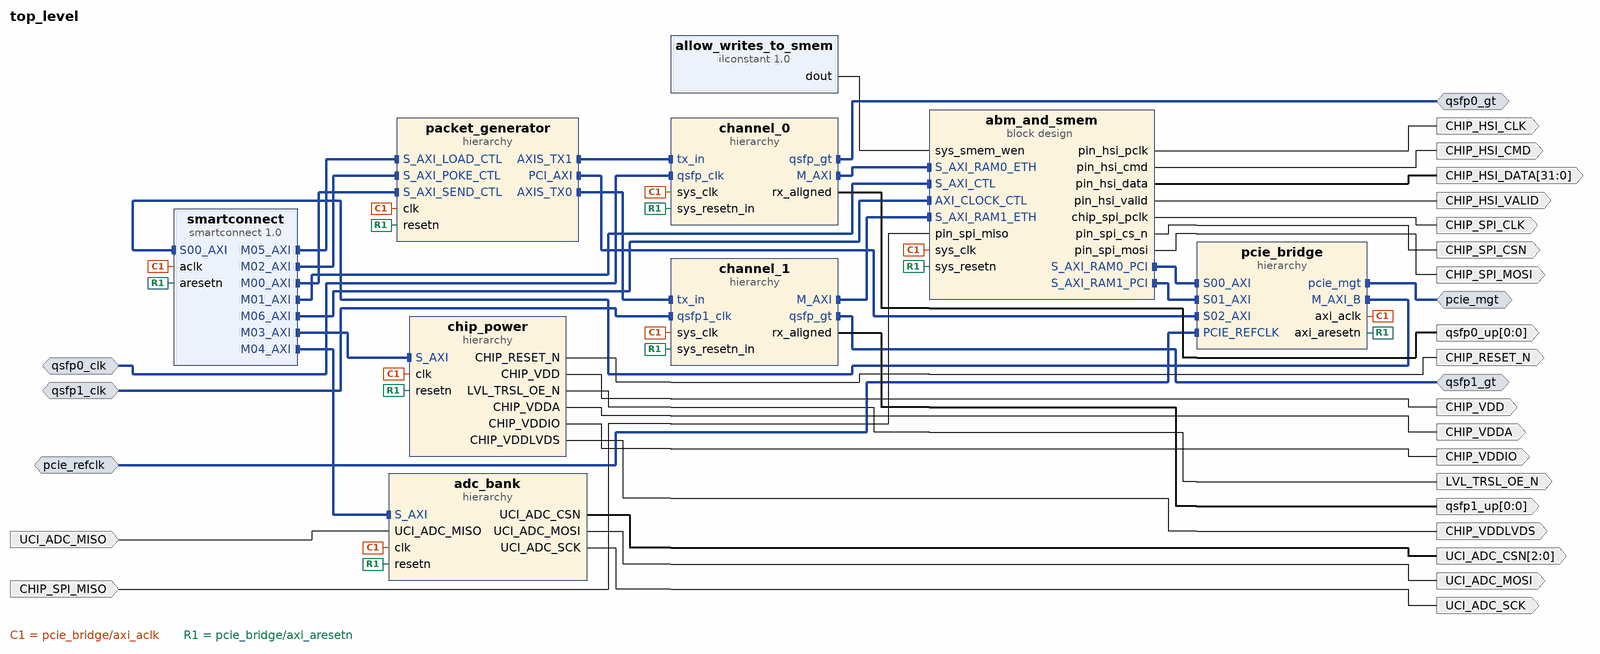
[diagram p0: block diagram of the top level]
# Vivado block design top_level, xcku15p-ffve1517-3-e, Vivado 2024.2
create_bd_design top_level

create_bd_intf_port -mode Slave -vlnv xilinx.com:interface:diff_clock_rtl:1.0 pcie_refclk
create_bd_intf_port -mode Master -vlnv xilinx.com:interface:pcie_7x_mgt_rtl:1.0 pcie_mgt
create_bd_intf_port -mode Master -vlnv xilinx.com:interface:gt_rtl:1.0 qsfp0_gt
create_bd_intf_port -mode Slave -vlnv xilinx.com:interface:diff_clock_rtl:1.0 qsfp0_clk
set_property -dict {CONFIG.FREQ_HZ 322265625} [get_bd_intf_ports qsfp0_clk]
create_bd_intf_port -mode Master -vlnv xilinx.com:interface:gt_rtl:1.0 qsfp1_gt
create_bd_intf_port -mode Slave -vlnv xilinx.com:interface:diff_clock_rtl:1.0 qsfp1_clk
set_property -dict {CONFIG.FREQ_HZ 322265625} [get_bd_intf_ports qsfp1_clk]
create_bd_port -dir O -from 0 -to 0 qsfp0_up
create_bd_port -dir O -from 0 -to 0 qsfp1_up
create_bd_port -dir O CHIP_HSI_CLK
create_bd_port -dir O CHIP_HSI_CMD
create_bd_port -dir O -from 31 -to 0 CHIP_HSI_DATA
create_bd_port -dir O CHIP_HSI_VALID
create_bd_port -dir O CHIP_SPI_CLK
create_bd_port -dir O CHIP_SPI_CSN
create_bd_port -dir O CHIP_SPI_MOSI
create_bd_port -dir I CHIP_SPI_MISO
create_bd_port -dir O CHIP_VDDIO
create_bd_port -dir O CHIP_VDD
create_bd_port -dir O CHIP_VDDLVDS
create_bd_port -dir O CHIP_VDDA
create_bd_port -dir O CHIP_RESET_N
create_bd_port -dir O -from 2 -to 0 UCI_ADC_CSN
create_bd_port -dir O UCI_ADC_SCK
create_bd_port -dir O UCI_ADC_MOSI
create_bd_port -dir I UCI_ADC_MISO
create_bd_port -dir O LVL_TRSL_OE_N

create_bd_cell -type hier pcie_bridge
create_bd_cell -type ip -vlnv xilinx.com:ip:smartconnect:1.0 smartconnect
set_property -dict {CONFIG.NUM_MI 7 CONFIG.NUM_SI 1} [get_bd_cells smartconnect]
create_bd_cell -type hier packet_generator
create_bd_cell -type inline_hdl -vlnv xilinx.com:inline_hdl:ilconstant:1.0 allow_writes_to_smem
create_bd_cell -type container -reference abm_and_smem abm_and_smem
set_property -dict [list \
  CONFIG.ACTIVE_SIM_BD abm_and_smem.bd \
  CONFIG.ACTIVE_SYNTH_BD abm_and_smem.bd \
  CONFIG.ENABLE_DFX 0 \
  CONFIG.LIST_SIM_BD abm_and_smem.bd \
  CONFIG.LIST_SYNTH_BD abm_and_smem.bd \
  CONFIG.LOCK_PROPAGATE 0 \
] [get_bd_cells abm_and_smem]
create_bd_cell -type hier chip_power
create_bd_cell -type hier channel_1
create_bd_cell -type hier adc_bank
create_bd_cell -type hier channel_0

# ---- hierarchy /pcie_bridge ----
current_bd_instance /pcie_bridge
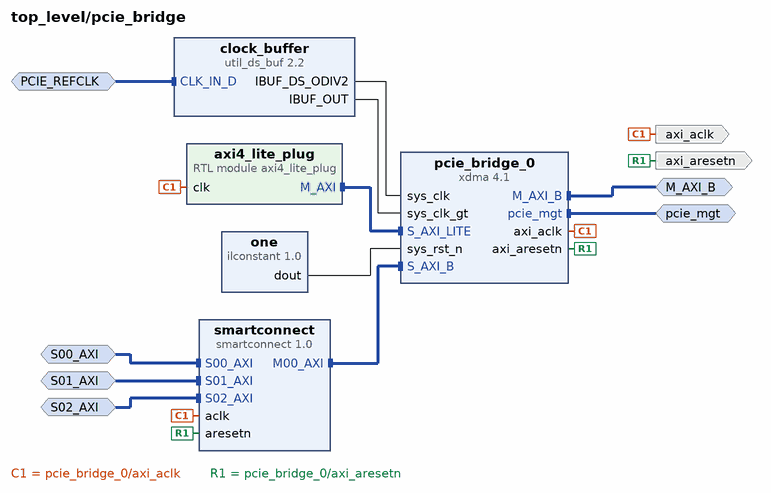
[diagram p1: block diagram inside /pcie_bridge]
create_bd_intf_pin -mode Slave -vlnv xilinx.com:interface:diff_clock_rtl:1.0 PCIE_REFCLK
create_bd_intf_pin -mode Slave -vlnv xilinx.com:interface:aximm_rtl:1.0 S00_AXI
create_bd_intf_pin -mode Slave -vlnv xilinx.com:interface:aximm_rtl:1.0 S01_AXI
create_bd_intf_pin -mode Master -vlnv xilinx.com:interface:pcie_7x_mgt_rtl:1.0 pcie_mgt
create_bd_intf_pin -mode Master -vlnv xilinx.com:interface:aximm_rtl:1.0 M_AXI_B
create_bd_intf_pin -mode Slave -vlnv xilinx.com:interface:aximm_rtl:1.0 S02_AXI
create_bd_pin -dir O -type clk axi_aclk
create_bd_pin -dir O -type rst axi_aresetn

create_bd_cell -type ip -vlnv xilinx.com:ip:util_ds_buf:2.2 clock_buffer
set_property -dict {CONFIG.C_BUF_TYPE IBUFDSGTE} [get_bd_cells clock_buffer]
create_bd_cell -type ip -vlnv xilinx.com:ip:smartconnect:1.0 smartconnect
set_property -dict {CONFIG.NUM_MI 1 CONFIG.NUM_SI 3} [get_bd_cells smartconnect]
create_bd_cell -type module -reference axi4_lite_plug axi4_lite_plug
create_bd_cell -type ip -vlnv xilinx.com:ip:xdma:4.1 pcie_bridge_0
set_property -dict [list \
  CONFIG.PF0_DEVICE_ID_mqdma 903F \
  CONFIG.PF0_SRIOV_VF_DEVICE_ID A03F \
  CONFIG.PF2_DEVICE_ID_mqdma 923F \
  CONFIG.PF3_DEVICE_ID_mqdma 933F \
  CONFIG.axi_addr_width 64 \
  CONFIG.axi_data_width 512_bit \
  CONFIG.axisten_freq 250 \
  CONFIG.bridge_burst true \
  CONFIG.en_axi_slave_if true \
  CONFIG.en_gt_selection false \
  CONFIG.functional_mode AXI_Bridge \
  CONFIG.mode_selection Advanced \
  CONFIG.pcie_blk_locn X0Y3 \
  CONFIG.pf0_bar0_scale Megabytes \
  CONFIG.pf0_bar0_size 1 \
  CONFIG.pf0_device_id 903F \
  CONFIG.pf0_msi_enabled false \
  CONFIG.pl_link_cap_max_link_speed 8.0_GT/s \
  CONFIG.pl_link_cap_max_link_width X16 \
  CONFIG.runbit_fix false \
  CONFIG.xlnx_ref_board None \
] [get_bd_cells pcie_bridge_0]
create_bd_cell -type inline_hdl -vlnv xilinx.com:inline_hdl:ilconstant:1.0 one

# ---- hierarchy /packet_generator ----
current_bd_instance /packet_generator
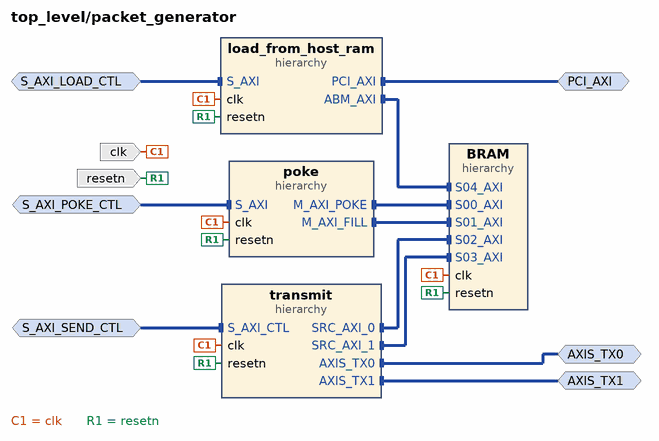
[diagram p2: block diagram inside /packet_generator]
create_bd_intf_pin -mode Slave -vlnv xilinx.com:interface:aximm_rtl:1.0 S_AXI_POKE_CTL
create_bd_intf_pin -mode Slave -vlnv xilinx.com:interface:aximm_rtl:1.0 S_AXI_SEND_CTL
create_bd_intf_pin -mode Master -vlnv xilinx.com:interface:axis_rtl:1.0 AXIS_TX0
create_bd_intf_pin -mode Master -vlnv xilinx.com:interface:axis_rtl:1.0 AXIS_TX1
create_bd_intf_pin -mode Slave -vlnv xilinx.com:interface:aximm_rtl:1.0 S_AXI_LOAD_CTL
create_bd_intf_pin -mode Master -vlnv xilinx.com:interface:aximm_rtl:1.0 PCI_AXI
create_bd_pin -dir I resetn
create_bd_pin -dir I clk

create_bd_cell -type hier poke
create_bd_cell -type hier transmit
create_bd_cell -type hier BRAM
create_bd_cell -type hier load_from_host_ram

# ---- hierarchy /packet_generator/poke ----
current_bd_instance /packet_generator/poke
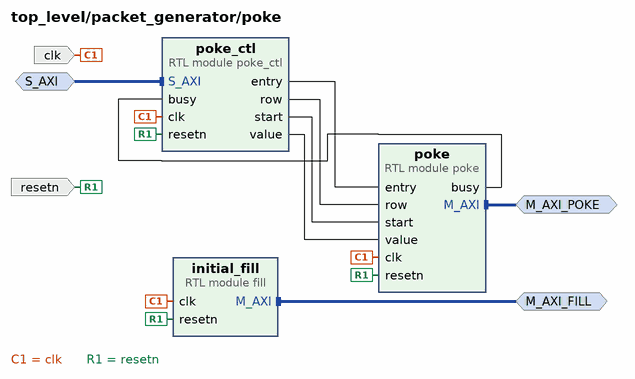
[diagram p3: block diagram inside /packet_generator/poke]
create_bd_intf_pin -mode Slave -vlnv xilinx.com:interface:aximm_rtl:1.0 S_AXI
create_bd_intf_pin -mode Master -vlnv xilinx.com:interface:aximm_rtl:1.0 M_AXI_POKE
create_bd_intf_pin -mode Master -vlnv xilinx.com:interface:aximm_rtl:1.0 M_AXI_FILL
create_bd_pin -dir I clk
create_bd_pin -dir I resetn

create_bd_cell -type module -reference poke_ctl poke_ctl
create_bd_cell -type module -reference poke poke
create_bd_cell -type module -reference fill initial_fill

# ---- hierarchy /packet_generator/transmit ----
current_bd_instance /packet_generator/transmit
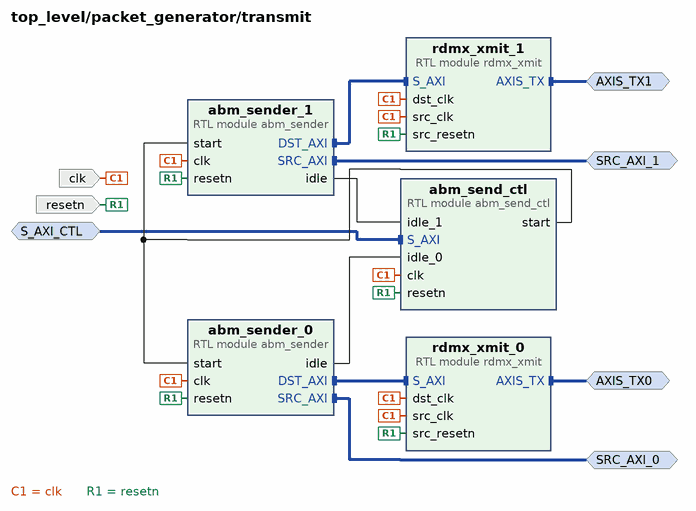
[diagram p4: block diagram inside /packet_generator/transmit]
create_bd_intf_pin -mode Master -vlnv xilinx.com:interface:aximm_rtl:1.0 SRC_AXI_0
create_bd_intf_pin -mode Master -vlnv xilinx.com:interface:axis_rtl:1.0 AXIS_TX0
create_bd_intf_pin -mode Master -vlnv xilinx.com:interface:axis_rtl:1.0 AXIS_TX1
create_bd_intf_pin -mode Master -vlnv xilinx.com:interface:aximm_rtl:1.0 SRC_AXI_1
create_bd_intf_pin -mode Slave -vlnv xilinx.com:interface:aximm_rtl:1.0 S_AXI_CTL
create_bd_pin -dir I clk
create_bd_pin -dir I resetn

create_bd_cell -type module -reference abm_sender abm_sender_0
create_bd_cell -type module -reference rdmx_xmit rdmx_xmit_0
set_property -dict {CONFIG.FIFO_CLOCK_MODE common_clk CONFIG.SRC_MAC 0} [get_bd_cells rdmx_xmit_0]
create_bd_cell -type module -reference rdmx_xmit rdmx_xmit_1
set_property -dict {CONFIG.FIFO_CLOCK_MODE common_clk CONFIG.SRC_MAC 1} [get_bd_cells rdmx_xmit_1]
create_bd_cell -type module -reference abm_sender abm_sender_1
create_bd_cell -type module -reference abm_send_ctl abm_send_ctl

# ---- hierarchy /packet_generator/BRAM ----
current_bd_instance /packet_generator/BRAM
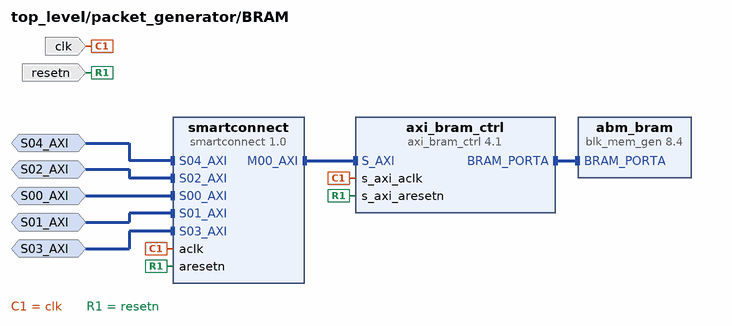
[diagram p5: block diagram inside /packet_generator/BRAM]
create_bd_intf_pin -mode Slave -vlnv xilinx.com:interface:aximm_rtl:1.0 S00_AXI
create_bd_intf_pin -mode Slave -vlnv xilinx.com:interface:aximm_rtl:1.0 S01_AXI
create_bd_intf_pin -mode Slave -vlnv xilinx.com:interface:aximm_rtl:1.0 S02_AXI
create_bd_intf_pin -mode Slave -vlnv xilinx.com:interface:aximm_rtl:1.0 S03_AXI
create_bd_intf_pin -mode Slave -vlnv xilinx.com:interface:aximm_rtl:1.0 S04_AXI
create_bd_pin -dir I clk
create_bd_pin -dir I resetn

create_bd_cell -type ip -vlnv xilinx.com:ip:smartconnect:1.0 smartconnect
set_property -dict {CONFIG.NUM_SI 5} [get_bd_cells smartconnect]
create_bd_cell -type ip -vlnv xilinx.com:ip:axi_bram_ctrl:4.1 axi_bram_ctrl
set_property -dict {CONFIG.DATA_WIDTH 512 CONFIG.SINGLE_PORT_BRAM 1 CONFIG.SUPPORTS_NARROW_BURST 0} [get_bd_cells axi_bram_ctrl]
create_bd_cell -type ip -vlnv xilinx.com:ip:blk_mem_gen:8.4 abm_bram
set_property -dict {CONFIG.PRIM_type_to_Implement URAM} [get_bd_cells abm_bram]

# ---- hierarchy /packet_generator/load_from_host_ram ----
current_bd_instance /packet_generator/load_from_host_ram
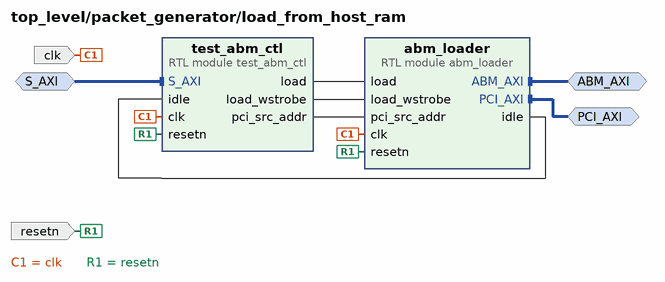
[diagram p6: block diagram inside /packet_generator/load_from_host_ram]
create_bd_intf_pin -mode Slave -vlnv xilinx.com:interface:aximm_rtl:1.0 S_AXI
create_bd_intf_pin -mode Master -vlnv xilinx.com:interface:aximm_rtl:1.0 ABM_AXI
create_bd_intf_pin -mode Master -vlnv xilinx.com:interface:aximm_rtl:1.0 PCI_AXI
create_bd_pin -dir I clk
create_bd_pin -dir I resetn

create_bd_cell -type module -reference test_abm_ctl test_abm_ctl
create_bd_cell -type module -reference abm_loader abm_loader

# ---- hierarchy /chip_power ----
current_bd_instance /chip_power
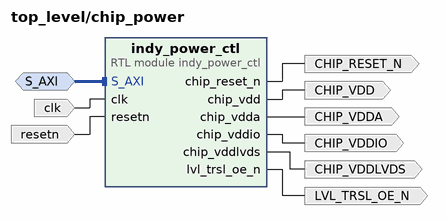
[diagram p7: block diagram inside /chip_power]
create_bd_intf_pin -mode Slave -vlnv xilinx.com:interface:aximm_rtl:1.0 S_AXI
create_bd_pin -dir I -type clk clk
create_bd_pin -dir I -type rst resetn
create_bd_pin -dir O CHIP_VDDIO
create_bd_pin -dir O CHIP_VDD
create_bd_pin -dir O CHIP_VDDLVDS
create_bd_pin -dir O CHIP_VDDA
create_bd_pin -dir O CHIP_RESET_N
create_bd_pin -dir O LVL_TRSL_OE_N

create_bd_cell -type module -reference indy_power_ctl indy_power_ctl

# ---- hierarchy /channel_1 ----
current_bd_instance /channel_1
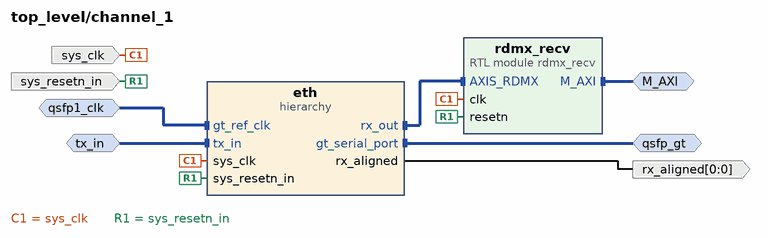
[diagram p8: block diagram inside /channel_1]
create_bd_intf_pin -mode Master -vlnv xilinx.com:interface:gt_rtl:1.0 qsfp_gt
create_bd_intf_pin -mode Slave -vlnv xilinx.com:interface:diff_clock_rtl:1.0 qsfp1_clk
create_bd_intf_pin -mode Slave -vlnv xilinx.com:interface:axis_rtl:1.0 tx_in
create_bd_intf_pin -mode Master -vlnv xilinx.com:interface:aximm_rtl:1.0 M_AXI
create_bd_pin -dir I sys_clk
create_bd_pin -dir I sys_resetn_in
create_bd_pin -dir O -from 0 -to 0 rx_aligned

create_bd_cell -type hier eth
create_bd_cell -type module -reference rdmx_recv rdmx_recv

# ---- hierarchy /channel_1/eth ----
current_bd_instance /channel_1/eth
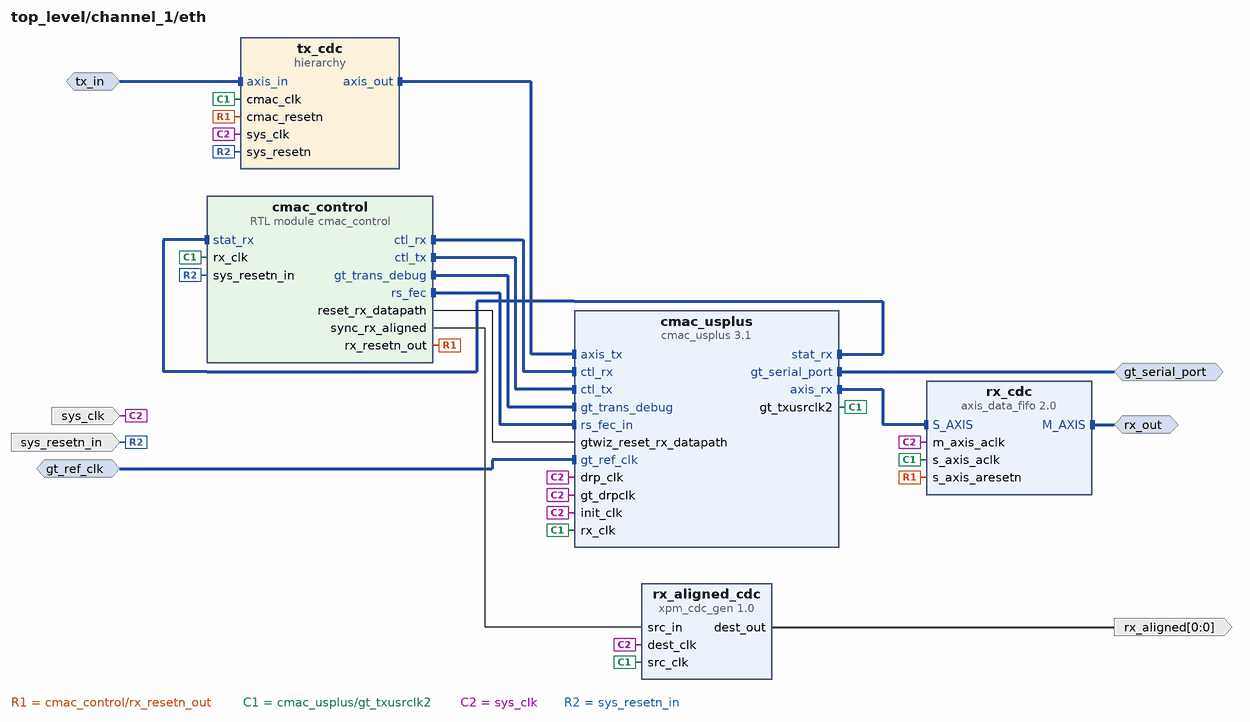
[diagram p9: block diagram inside /channel_1/eth]
create_bd_intf_pin -mode Master -vlnv xilinx.com:interface:gt_rtl:1.0 gt_serial_port
create_bd_intf_pin -mode Slave -vlnv xilinx.com:interface:diff_clock_rtl:1.0 gt_ref_clk
create_bd_intf_pin -mode Master -vlnv xilinx.com:interface:axis_rtl:1.0 rx_out
create_bd_intf_pin -mode Slave -vlnv xilinx.com:interface:axis_rtl:1.0 tx_in
create_bd_pin -dir I sys_resetn_in
create_bd_pin -dir I sys_clk
create_bd_pin -dir O -from 0 -to 0 rx_aligned

create_bd_cell -type ip -vlnv xilinx.com:ip:cmac_usplus:3.1 cmac_usplus
set_property -dict [list \
  CONFIG.ADD_GT_CNRL_STS_PORTS 1 \
  CONFIG.CMAC_CAUI4_MODE 1 \
  CONFIG.CMAC_CORE_SELECT CMACE4_X0Y1 \
  CONFIG.DIFFCLK_BOARD_INTERFACE Custom \
  CONFIG.ETHERNET_BOARD_INTERFACE Custom \
  CONFIG.GT_DRP_CLK 250 \
  CONFIG.GT_GROUP_SELECT {X0Y4~X0Y7} \
  CONFIG.GT_REF_CLK_FREQ 322.265625 \
  CONFIG.INCLUDE_RS_FEC 1 \
  CONFIG.NUM_LANES 4x25 \
  CONFIG.RX_FLOW_CONTROL 0 \
  CONFIG.RX_GT_BUFFER 1 \
  CONFIG.TX_FLOW_CONTROL 0 \
  CONFIG.USER_INTERFACE AXIS \
] [get_bd_cells cmac_usplus]
create_bd_cell -type module -reference cmac_control cmac_control
set_property -dict {CONFIG.TX_PRECURSOR {"10100"}} [get_bd_cells cmac_control]
create_bd_cell -type ip -vlnv xilinx.com:ip:axis_data_fifo:2.0 rx_cdc
set_property -dict {CONFIG.FIFO_DEPTH 16 CONFIG.IS_ACLK_ASYNC 1} [get_bd_cells rx_cdc]
create_bd_cell -type ip -vlnv xilinx.com:ip:xpm_cdc_gen:1.0 rx_aligned_cdc
set_property -dict [list \
  CONFIG.CDC_TYPE xpm_cdc_single \
  CONFIG.SIM_ASSERT_CHK false \
  CONFIG.SRC_INPUT_REG false \
  CONFIG.WIDTH 1 \
] [get_bd_cells rx_aligned_cdc]
create_bd_cell -type hier tx_cdc

# ---- hierarchy /channel_1/eth/tx_cdc ----
current_bd_instance /channel_1/eth/tx_cdc
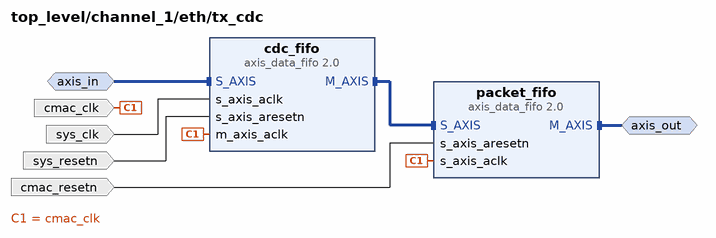
[diagram p10: block diagram inside /channel_1/eth/tx_cdc]
create_bd_intf_pin -mode Slave -vlnv xilinx.com:interface:axis_rtl:1.0 axis_in
create_bd_intf_pin -mode Master -vlnv xilinx.com:interface:axis_rtl:1.0 axis_out
create_bd_pin -dir I sys_clk
create_bd_pin -dir I sys_resetn
create_bd_pin -dir I cmac_clk
create_bd_pin -dir I cmac_resetn

create_bd_cell -type ip -vlnv xilinx.com:ip:axis_data_fifo:2.0 cdc_fifo
set_property -dict {CONFIG.FIFO_DEPTH 16 CONFIG.IS_ACLK_ASYNC 1} [get_bd_cells cdc_fifo]
create_bd_cell -type ip -vlnv xilinx.com:ip:axis_data_fifo:2.0 packet_fifo
set_property -dict {CONFIG.FIFO_MODE 2 CONFIG.IS_ACLK_ASYNC 0} [get_bd_cells packet_fifo]

# ---- hierarchy /adc_bank ----
current_bd_instance /adc_bank
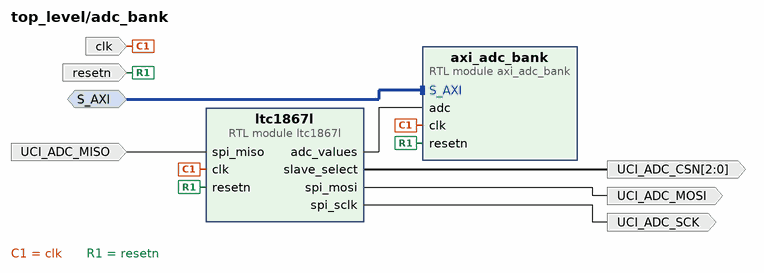
[diagram p11: block diagram inside /adc_bank]
create_bd_intf_pin -mode Slave -vlnv xilinx.com:interface:aximm_rtl:1.0 S_AXI
create_bd_pin -dir I -type clk clk
create_bd_pin -dir I -type rst resetn
create_bd_pin -dir O -from 2 -to 0 UCI_ADC_CSN
create_bd_pin -dir O UCI_ADC_SCK
create_bd_pin -dir O UCI_ADC_MOSI
create_bd_pin -dir I UCI_ADC_MISO

create_bd_cell -type module -reference axi_adc_bank axi_adc_bank
set_property -dict {CONFIG.ADC_COUNT 3} [get_bd_cells axi_adc_bank]
create_bd_cell -type module -reference ltc1867l ltc1867l
set_property -dict {CONFIG.ADC_COUNT 3} [get_bd_cells ltc1867l]

# ---- hierarchy /channel_0 ----
current_bd_instance /channel_0
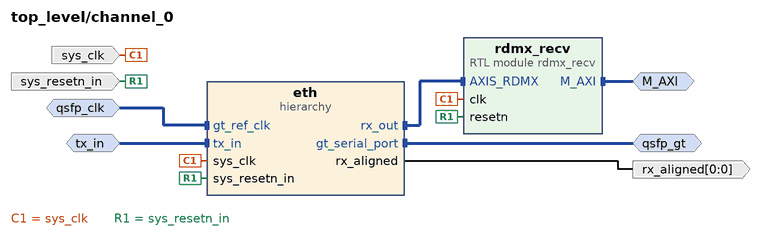
[diagram p12: block diagram inside /channel_0]
create_bd_intf_pin -mode Master -vlnv xilinx.com:interface:gt_rtl:1.0 qsfp_gt
create_bd_intf_pin -mode Slave -vlnv xilinx.com:interface:diff_clock_rtl:1.0 qsfp_clk
create_bd_intf_pin -mode Slave -vlnv xilinx.com:interface:axis_rtl:1.0 tx_in
create_bd_intf_pin -mode Master -vlnv xilinx.com:interface:aximm_rtl:1.0 M_AXI
create_bd_pin -dir I sys_clk
create_bd_pin -dir I sys_resetn_in
create_bd_pin -dir O -from 0 -to 0 rx_aligned

create_bd_cell -type hier eth
create_bd_cell -type module -reference rdmx_recv rdmx_recv

# ---- hierarchy /channel_0/eth ----
current_bd_instance /channel_0/eth
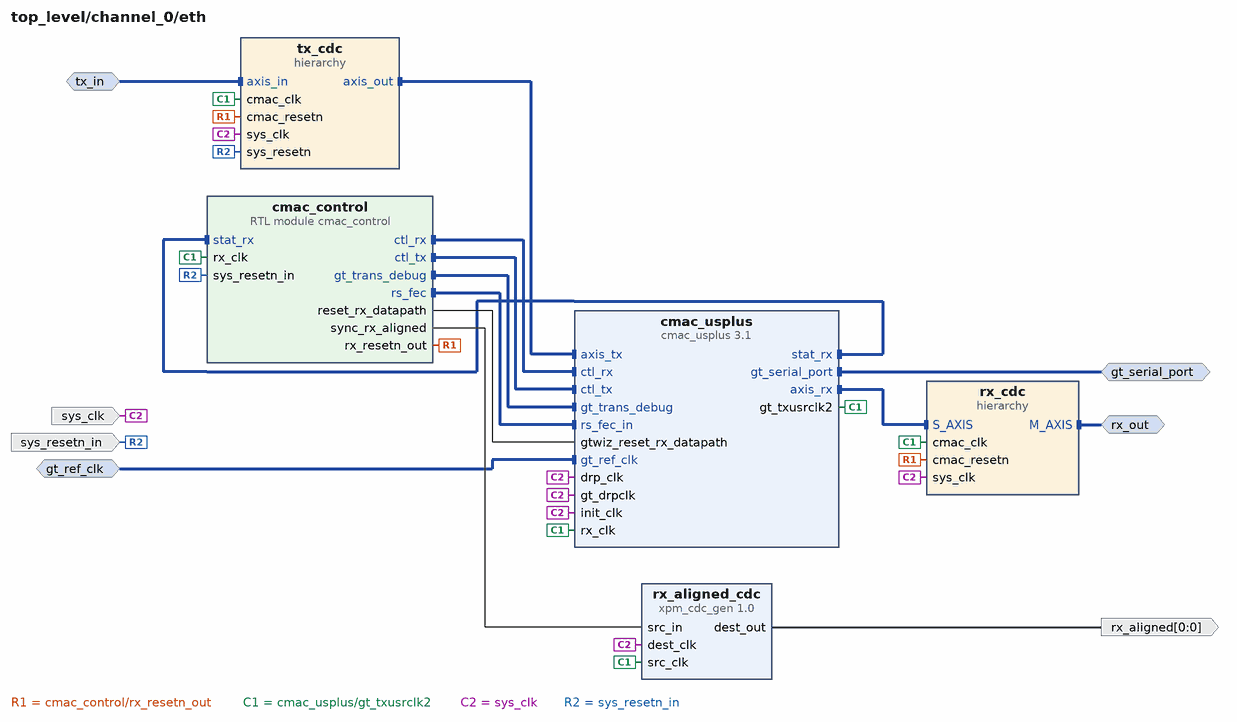
[diagram p13: block diagram inside /channel_0/eth]
create_bd_intf_pin -mode Master -vlnv xilinx.com:interface:gt_rtl:1.0 gt_serial_port
create_bd_intf_pin -mode Slave -vlnv xilinx.com:interface:diff_clock_rtl:1.0 gt_ref_clk
create_bd_intf_pin -mode Master -vlnv xilinx.com:interface:axis_rtl:1.0 rx_out
create_bd_intf_pin -mode Slave -vlnv xilinx.com:interface:axis_rtl:1.0 tx_in
create_bd_pin -dir I sys_resetn_in
create_bd_pin -dir I sys_clk
create_bd_pin -dir O -from 0 -to 0 rx_aligned

create_bd_cell -type ip -vlnv xilinx.com:ip:cmac_usplus:3.1 cmac_usplus
set_property -dict [list \
  CONFIG.ADD_GT_CNRL_STS_PORTS 1 \
  CONFIG.CMAC_CAUI4_MODE 1 \
  CONFIG.CMAC_CORE_SELECT CMACE4_X0Y0 \
  CONFIG.DIFFCLK_BOARD_INTERFACE Custom \
  CONFIG.ETHERNET_BOARD_INTERFACE Custom \
  CONFIG.GT_DRP_CLK 250 \
  CONFIG.GT_GROUP_SELECT {X0Y0~X0Y3} \
  CONFIG.GT_REF_CLK_FREQ 322.265625 \
  CONFIG.INCLUDE_RS_FEC 1 \
  CONFIG.NUM_LANES 4x25 \
  CONFIG.RX_FLOW_CONTROL 0 \
  CONFIG.RX_GT_BUFFER 1 \
  CONFIG.TX_FLOW_CONTROL 0 \
  CONFIG.USER_INTERFACE AXIS \
] [get_bd_cells cmac_usplus]
create_bd_cell -type module -reference cmac_control cmac_control
set_property -dict {CONFIG.TX_PRECURSOR {"10100"}} [get_bd_cells cmac_control]
create_bd_cell -type ip -vlnv xilinx.com:ip:xpm_cdc_gen:1.0 rx_aligned_cdc
set_property -dict [list \
  CONFIG.CDC_TYPE xpm_cdc_single \
  CONFIG.SIM_ASSERT_CHK false \
  CONFIG.SRC_INPUT_REG false \
  CONFIG.WIDTH 1 \
] [get_bd_cells rx_aligned_cdc]
create_bd_cell -type hier tx_cdc
create_bd_cell -type hier rx_cdc

# ---- hierarchy /channel_0/eth/tx_cdc ----
current_bd_instance /channel_0/eth/tx_cdc
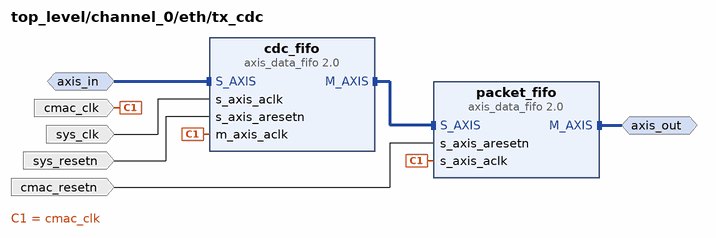
[diagram p14: block diagram inside /channel_0/eth/tx_cdc]
create_bd_intf_pin -mode Slave -vlnv xilinx.com:interface:axis_rtl:1.0 axis_in
create_bd_intf_pin -mode Master -vlnv xilinx.com:interface:axis_rtl:1.0 axis_out
create_bd_pin -dir I sys_clk
create_bd_pin -dir I sys_resetn
create_bd_pin -dir I cmac_clk
create_bd_pin -dir I cmac_resetn

create_bd_cell -type ip -vlnv xilinx.com:ip:axis_data_fifo:2.0 cdc_fifo
set_property -dict {CONFIG.FIFO_DEPTH 16 CONFIG.IS_ACLK_ASYNC 1} [get_bd_cells cdc_fifo]
create_bd_cell -type ip -vlnv xilinx.com:ip:axis_data_fifo:2.0 packet_fifo
set_property -dict {CONFIG.FIFO_MODE 2 CONFIG.IS_ACLK_ASYNC 0} [get_bd_cells packet_fifo]

# ---- hierarchy /channel_0/eth/rx_cdc ----
current_bd_instance /channel_0/eth/rx_cdc
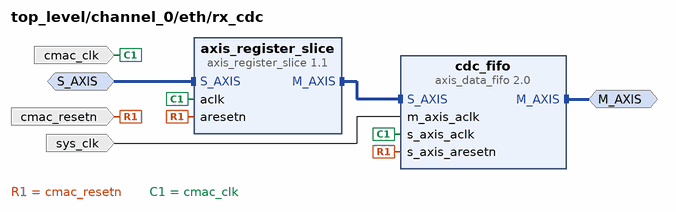
[diagram p15: block diagram inside /channel_0/eth/rx_cdc]
create_bd_intf_pin -mode Slave -vlnv xilinx.com:interface:axis_rtl:1.0 S_AXIS
create_bd_intf_pin -mode Master -vlnv xilinx.com:interface:axis_rtl:1.0 M_AXIS
create_bd_pin -dir I -type rst cmac_resetn
create_bd_pin -dir I -type clk cmac_clk
create_bd_pin -dir I sys_clk

create_bd_cell -type ip -vlnv xilinx.com:ip:axis_data_fifo:2.0 cdc_fifo
set_property -dict {CONFIG.FIFO_DEPTH 16 CONFIG.IS_ACLK_ASYNC 1} [get_bd_cells cdc_fifo]
create_bd_cell -type ip -vlnv xilinx.com:ip:axis_register_slice:1.1 axis_register_slice

# ---- connections ----

current_bd_instance /pcie_bridge
connect_bd_intf_net [get_bd_intf_pins PCIE_REFCLK] [get_bd_intf_pins clock_buffer/CLK_IN_D]
connect_bd_intf_net [get_bd_intf_pins pcie_bridge_0/pcie_mgt] [get_bd_intf_pins pcie_mgt]
connect_bd_intf_net [get_bd_intf_pins pcie_bridge_0/M_AXI_B] [get_bd_intf_pins M_AXI_B]
connect_bd_intf_net [get_bd_intf_pins S00_AXI] [get_bd_intf_pins smartconnect/S00_AXI]
connect_bd_intf_net [get_bd_intf_pins S01_AXI] [get_bd_intf_pins smartconnect/S01_AXI]
connect_bd_intf_net [get_bd_intf_pins S02_AXI] [get_bd_intf_pins smartconnect/S02_AXI]
connect_bd_intf_net [get_bd_intf_pins axi4_lite_plug/M_AXI] [get_bd_intf_pins pcie_bridge_0/S_AXI_LITE]
connect_bd_intf_net [get_bd_intf_pins smartconnect/M00_AXI] [get_bd_intf_pins pcie_bridge_0/S_AXI_B]
connect_bd_net [get_bd_pins clock_buffer/IBUF_DS_ODIV2] [get_bd_pins pcie_bridge_0/sys_clk]
connect_bd_net [get_bd_pins clock_buffer/IBUF_OUT] [get_bd_pins pcie_bridge_0/sys_clk_gt]
connect_bd_net [get_bd_pins one/dout] [get_bd_pins pcie_bridge_0/sys_rst_n]
connect_bd_net [get_bd_pins pcie_bridge_0/axi_aclk] [get_bd_pins axi_aclk] [get_bd_pins smartconnect/aclk] [get_bd_pins axi4_lite_plug/clk]
connect_bd_net [get_bd_pins pcie_bridge_0/axi_aresetn] [get_bd_pins axi_aresetn] [get_bd_pins smartconnect/aresetn]

current_bd_instance /packet_generator
connect_bd_intf_net [get_bd_intf_pins S_AXI_LOAD_CTL] [get_bd_intf_pins load_from_host_ram/S_AXI]
connect_bd_intf_net [get_bd_intf_pins S_AXI_POKE_CTL] [get_bd_intf_pins poke/S_AXI]
connect_bd_intf_net [get_bd_intf_pins S_AXI_SEND_CTL] [get_bd_intf_pins transmit/S_AXI_CTL]
connect_bd_intf_net [get_bd_intf_pins transmit/SRC_AXI_0] [get_bd_intf_pins BRAM/S02_AXI]
connect_bd_intf_net [get_bd_intf_pins load_from_host_ram/ABM_AXI] [get_bd_intf_pins BRAM/S04_AXI]
connect_bd_intf_net [get_bd_intf_pins PCI_AXI] [get_bd_intf_pins load_from_host_ram/PCI_AXI]
connect_bd_intf_net [get_bd_intf_pins poke/M_AXI_POKE] [get_bd_intf_pins BRAM/S00_AXI]
connect_bd_intf_net [get_bd_intf_pins BRAM/S01_AXI] [get_bd_intf_pins poke/M_AXI_FILL]
connect_bd_intf_net [get_bd_intf_pins AXIS_TX0] [get_bd_intf_pins transmit/AXIS_TX0]
connect_bd_intf_net [get_bd_intf_pins AXIS_TX1] [get_bd_intf_pins transmit/AXIS_TX1]
connect_bd_intf_net [get_bd_intf_pins transmit/SRC_AXI_1] [get_bd_intf_pins BRAM/S03_AXI]
connect_bd_net -net s_axi_aclk_1 [get_bd_pins clk] \
  [get_bd_pins poke/clk] [get_bd_pins transmit/clk] [get_bd_pins BRAM/clk] [get_bd_pins load_from_host_ram/clk]
connect_bd_net -net s_axi_aresetn_1 [get_bd_pins resetn] \
  [get_bd_pins poke/resetn] [get_bd_pins transmit/resetn] [get_bd_pins BRAM/resetn] [get_bd_pins load_from_host_ram/resetn]

current_bd_instance /packet_generator/poke
connect_bd_intf_net [get_bd_intf_pins initial_fill/M_AXI] [get_bd_intf_pins M_AXI_FILL]
connect_bd_intf_net [get_bd_intf_pins S_AXI] [get_bd_intf_pins poke_ctl/S_AXI]
connect_bd_intf_net [get_bd_intf_pins M_AXI_POKE] [get_bd_intf_pins poke/M_AXI]
connect_bd_net [get_bd_pins poke/busy] [get_bd_pins poke_ctl/busy]
connect_bd_net -net poke_ctl_0_entry [get_bd_pins poke_ctl/entry] [get_bd_pins poke/entry]
connect_bd_net -net poke_ctl_0_row [get_bd_pins poke_ctl/row] [get_bd_pins poke/row]
connect_bd_net -net poke_ctl_0_start [get_bd_pins poke_ctl/start] [get_bd_pins poke/start]
connect_bd_net -net poke_ctl_0_value [get_bd_pins poke_ctl/value] [get_bd_pins poke/value]
connect_bd_net -net s_axi_aclk_1 [get_bd_pins clk] [get_bd_pins poke_ctl/clk] [get_bd_pins initial_fill/clk] [get_bd_pins poke/clk]
connect_bd_net -net s_axi_aresetn_1 [get_bd_pins resetn] [get_bd_pins poke_ctl/resetn] [get_bd_pins initial_fill/resetn] [get_bd_pins poke/resetn]

current_bd_instance /packet_generator/transmit
connect_bd_intf_net [get_bd_intf_pins S_AXI_CTL] [get_bd_intf_pins abm_send_ctl/S_AXI]
connect_bd_intf_net [get_bd_intf_pins rdmx_xmit_0/S_AXI] [get_bd_intf_pins abm_sender_0/DST_AXI]
connect_bd_intf_net [get_bd_intf_pins SRC_AXI_0] [get_bd_intf_pins abm_sender_0/SRC_AXI]
connect_bd_intf_net [get_bd_intf_pins abm_sender_1/DST_AXI] [get_bd_intf_pins rdmx_xmit_1/S_AXI]
connect_bd_intf_net [get_bd_intf_pins SRC_AXI_1] [get_bd_intf_pins abm_sender_1/SRC_AXI]
connect_bd_intf_net [get_bd_intf_pins AXIS_TX0] [get_bd_intf_pins rdmx_xmit_0/AXIS_TX]
connect_bd_intf_net [get_bd_intf_pins AXIS_TX1] [get_bd_intf_pins rdmx_xmit_1/AXIS_TX]
connect_bd_net [get_bd_pins abm_send_ctl/start] [get_bd_pins abm_sender_0/start] [get_bd_pins abm_sender_1/start]
connect_bd_net [get_bd_pins abm_sender_0/idle] [get_bd_pins abm_send_ctl/idle_0]
connect_bd_net [get_bd_pins abm_sender_1/idle] [get_bd_pins abm_send_ctl/idle_1]
connect_bd_net [get_bd_pins clk] \
  [get_bd_pins abm_send_ctl/clk] [get_bd_pins abm_sender_0/clk] [get_bd_pins abm_sender_1/clk] \
  [get_bd_pins rdmx_xmit_0/src_clk] [get_bd_pins rdmx_xmit_0/dst_clk] [get_bd_pins rdmx_xmit_1/src_clk] \
  [get_bd_pins rdmx_xmit_1/dst_clk]
connect_bd_net [get_bd_pins resetn] \
  [get_bd_pins abm_send_ctl/resetn] [get_bd_pins abm_sender_0/resetn] [get_bd_pins abm_sender_1/resetn] \
  [get_bd_pins rdmx_xmit_0/src_resetn] [get_bd_pins rdmx_xmit_1/src_resetn]

current_bd_instance /packet_generator/BRAM
connect_bd_intf_net [get_bd_intf_pins S04_AXI] [get_bd_intf_pins smartconnect/S04_AXI]
connect_bd_intf_net [get_bd_intf_pins S02_AXI] [get_bd_intf_pins smartconnect/S02_AXI]
connect_bd_intf_net [get_bd_intf_pins abm_bram/BRAM_PORTA] [get_bd_intf_pins axi_bram_ctrl/BRAM_PORTA]
connect_bd_intf_net [get_bd_intf_pins S00_AXI] [get_bd_intf_pins smartconnect/S00_AXI]
connect_bd_intf_net [get_bd_intf_pins S01_AXI] [get_bd_intf_pins smartconnect/S01_AXI]
connect_bd_intf_net [get_bd_intf_pins smartconnect/M00_AXI] [get_bd_intf_pins axi_bram_ctrl/S_AXI]
connect_bd_intf_net [get_bd_intf_pins S03_AXI] [get_bd_intf_pins smartconnect/S03_AXI]
connect_bd_net -net s_axi_aclk_1 [get_bd_pins clk] [get_bd_pins axi_bram_ctrl/s_axi_aclk] [get_bd_pins smartconnect/aclk]
connect_bd_net -net s_axi_aresetn_1 [get_bd_pins resetn] [get_bd_pins axi_bram_ctrl/s_axi_aresetn] [get_bd_pins smartconnect/aresetn]

current_bd_instance /packet_generator/load_from_host_ram
connect_bd_intf_net [get_bd_intf_pins S_AXI] [get_bd_intf_pins test_abm_ctl/S_AXI]
connect_bd_intf_net [get_bd_intf_pins ABM_AXI] [get_bd_intf_pins abm_loader/ABM_AXI]
connect_bd_intf_net [get_bd_intf_pins PCI_AXI] [get_bd_intf_pins abm_loader/PCI_AXI]
connect_bd_net -net abm_loader_0_idle [get_bd_pins abm_loader/idle] [get_bd_pins test_abm_ctl/idle]
connect_bd_net -net s_axi_aclk_1 [get_bd_pins clk] [get_bd_pins test_abm_ctl/clk] [get_bd_pins abm_loader/clk]
connect_bd_net -net s_axi_aresetn_1 [get_bd_pins resetn] [get_bd_pins test_abm_ctl/resetn] [get_bd_pins abm_loader/resetn]
connect_bd_net [get_bd_pins test_abm_ctl/load] [get_bd_pins abm_loader/load]
connect_bd_net [get_bd_pins test_abm_ctl/load_wstrobe] [get_bd_pins abm_loader/load_wstrobe]
connect_bd_net [get_bd_pins test_abm_ctl/pci_src_addr] [get_bd_pins abm_loader/pci_src_addr]

current_bd_instance /chip_power
connect_bd_intf_net [get_bd_intf_pins S_AXI] [get_bd_intf_pins indy_power_ctl/S_AXI]
connect_bd_net -net indy_power_ctl_0_chip_reset_n [get_bd_pins indy_power_ctl/chip_reset_n] [get_bd_pins CHIP_RESET_N]
connect_bd_net [get_bd_pins indy_power_ctl/chip_vdd] [get_bd_pins CHIP_VDD]
connect_bd_net [get_bd_pins indy_power_ctl/chip_vdda] [get_bd_pins CHIP_VDDA]
connect_bd_net [get_bd_pins indy_power_ctl/chip_vddio] [get_bd_pins CHIP_VDDIO]
connect_bd_net [get_bd_pins indy_power_ctl/chip_vddlvds] [get_bd_pins CHIP_VDDLVDS]
connect_bd_net [get_bd_pins indy_power_ctl/lvl_trsl_oe_n] [get_bd_pins LVL_TRSL_OE_N]
connect_bd_net -net pcie_bridge_0_axi_aclk [get_bd_pins clk] [get_bd_pins indy_power_ctl/clk]
connect_bd_net -net pcie_bridge_0_axi_aresetn [get_bd_pins resetn] [get_bd_pins indy_power_ctl/resetn]

current_bd_instance /channel_1
connect_bd_intf_net [get_bd_intf_pins qsfp_gt] [get_bd_intf_pins eth/gt_serial_port]
connect_bd_intf_net [get_bd_intf_pins rdmx_recv/AXIS_RDMX] [get_bd_intf_pins eth/rx_out]
connect_bd_intf_net [get_bd_intf_pins qsfp1_clk] [get_bd_intf_pins eth/gt_ref_clk]
connect_bd_intf_net [get_bd_intf_pins M_AXI] [get_bd_intf_pins rdmx_recv/M_AXI]
connect_bd_intf_net [get_bd_intf_pins tx_in] [get_bd_intf_pins eth/tx_in]
connect_bd_net [get_bd_pins eth/rx_aligned] [get_bd_pins rx_aligned]
connect_bd_net -net pcie_bridge_0_axi_aclk [get_bd_pins sys_clk] [get_bd_pins eth/sys_clk] [get_bd_pins rdmx_recv/clk]
connect_bd_net -net pcie_bridge_0_axi_aresetn [get_bd_pins sys_resetn_in] [get_bd_pins eth/sys_resetn_in] [get_bd_pins rdmx_recv/resetn]

current_bd_instance /channel_1/eth
connect_bd_intf_net [get_bd_intf_pins rx_out] [get_bd_intf_pins rx_cdc/M_AXIS]
connect_bd_intf_net [get_bd_intf_pins cmac_control/ctl_rx] [get_bd_intf_pins cmac_usplus/ctl_rx]
connect_bd_intf_net [get_bd_intf_pins cmac_control/ctl_tx] [get_bd_intf_pins cmac_usplus/ctl_tx]
connect_bd_intf_net [get_bd_intf_pins cmac_control/gt_trans_debug] [get_bd_intf_pins cmac_usplus/gt_trans_debug]
connect_bd_intf_net [get_bd_intf_pins cmac_control/rs_fec] [get_bd_intf_pins cmac_usplus/rs_fec_in]
connect_bd_intf_net [get_bd_intf_pins cmac_usplus/axis_rx] [get_bd_intf_pins rx_cdc/S_AXIS]
connect_bd_intf_net [get_bd_intf_pins gt_serial_port] [get_bd_intf_pins cmac_usplus/gt_serial_port]
connect_bd_intf_net [get_bd_intf_pins cmac_control/stat_rx] [get_bd_intf_pins cmac_usplus/stat_rx]
connect_bd_intf_net [get_bd_intf_pins gt_ref_clk] [get_bd_intf_pins cmac_usplus/gt_ref_clk]
connect_bd_intf_net [get_bd_intf_pins tx_cdc/axis_out] [get_bd_intf_pins cmac_usplus/axis_tx]
connect_bd_intf_net [get_bd_intf_pins tx_in] [get_bd_intf_pins tx_cdc/axis_in]
connect_bd_net [get_bd_pins cmac_control/reset_rx_datapath] [get_bd_pins cmac_usplus/gtwiz_reset_rx_datapath]
connect_bd_net [get_bd_pins cmac_control/rx_resetn_out] [get_bd_pins tx_cdc/cmac_resetn] [get_bd_pins rx_cdc/s_axis_aresetn]
connect_bd_net [get_bd_pins cmac_control/sync_rx_aligned] [get_bd_pins rx_aligned_cdc/src_in]
connect_bd_net [get_bd_pins cmac_usplus/gt_txusrclk2] \
  [get_bd_pins tx_cdc/cmac_clk] [get_bd_pins cmac_usplus/rx_clk] [get_bd_pins rx_aligned_cdc/src_clk] \
  [get_bd_pins rx_cdc/s_axis_aclk] [get_bd_pins cmac_control/rx_clk]
connect_bd_net [get_bd_pins rx_aligned_cdc/dest_out] [get_bd_pins rx_aligned]
connect_bd_net [get_bd_pins sys_clk] \
  [get_bd_pins tx_cdc/sys_clk] [get_bd_pins cmac_usplus/gt_drpclk] [get_bd_pins cmac_usplus/init_clk] \
  [get_bd_pins cmac_usplus/drp_clk] [get_bd_pins rx_aligned_cdc/dest_clk] [get_bd_pins rx_cdc/m_axis_aclk]
connect_bd_net [get_bd_pins sys_resetn_in] [get_bd_pins tx_cdc/sys_resetn] [get_bd_pins cmac_control/sys_resetn_in]

current_bd_instance /channel_1/eth/tx_cdc
connect_bd_intf_net [get_bd_intf_pins axis_in] [get_bd_intf_pins cdc_fifo/S_AXIS]
connect_bd_intf_net [get_bd_intf_pins cdc_fifo/M_AXIS] [get_bd_intf_pins packet_fifo/S_AXIS]
connect_bd_intf_net [get_bd_intf_pins axis_out] [get_bd_intf_pins packet_fifo/M_AXIS]
connect_bd_net [get_bd_pins cmac_clk] [get_bd_pins cdc_fifo/m_axis_aclk] [get_bd_pins packet_fifo/s_axis_aclk]
connect_bd_net [get_bd_pins cmac_resetn] [get_bd_pins packet_fifo/s_axis_aresetn]
connect_bd_net [get_bd_pins sys_clk] [get_bd_pins cdc_fifo/s_axis_aclk]
connect_bd_net [get_bd_pins sys_resetn] [get_bd_pins cdc_fifo/s_axis_aresetn]

current_bd_instance /adc_bank
connect_bd_intf_net [get_bd_intf_pins S_AXI] [get_bd_intf_pins axi_adc_bank/S_AXI]
connect_bd_net [get_bd_pins UCI_ADC_MISO] [get_bd_pins ltc1867l/spi_miso]
connect_bd_net [get_bd_pins ltc1867l/adc_values] [get_bd_pins axi_adc_bank/adc]
connect_bd_net [get_bd_pins ltc1867l/slave_select] [get_bd_pins UCI_ADC_CSN]
connect_bd_net [get_bd_pins ltc1867l/spi_mosi] [get_bd_pins UCI_ADC_MOSI]
connect_bd_net [get_bd_pins ltc1867l/spi_sclk] [get_bd_pins UCI_ADC_SCK]
connect_bd_net -net pcie_bridge_0_axi_aclk [get_bd_pins clk] [get_bd_pins ltc1867l/clk] [get_bd_pins axi_adc_bank/clk]
connect_bd_net -net pcie_bridge_0_axi_aresetn [get_bd_pins resetn] [get_bd_pins ltc1867l/resetn] [get_bd_pins axi_adc_bank/resetn]

current_bd_instance /channel_0
connect_bd_intf_net [get_bd_intf_pins qsfp_gt] [get_bd_intf_pins eth/gt_serial_port]
connect_bd_intf_net [get_bd_intf_pins eth/rx_out] [get_bd_intf_pins rdmx_recv/AXIS_RDMX]
connect_bd_intf_net [get_bd_intf_pins qsfp_clk] [get_bd_intf_pins eth/gt_ref_clk]
connect_bd_intf_net [get_bd_intf_pins M_AXI] [get_bd_intf_pins rdmx_recv/M_AXI]
connect_bd_intf_net [get_bd_intf_pins tx_in] [get_bd_intf_pins eth/tx_in]
connect_bd_net [get_bd_pins eth/rx_aligned] [get_bd_pins rx_aligned]
connect_bd_net -net pcie_bridge_0_axi_aclk [get_bd_pins sys_clk] [get_bd_pins eth/sys_clk] [get_bd_pins rdmx_recv/clk]
connect_bd_net -net pcie_bridge_0_axi_aresetn [get_bd_pins sys_resetn_in] [get_bd_pins eth/sys_resetn_in] [get_bd_pins rdmx_recv/resetn]

current_bd_instance /channel_0/eth
connect_bd_intf_net [get_bd_intf_pins rx_out] [get_bd_intf_pins rx_cdc/M_AXIS]
connect_bd_intf_net [get_bd_intf_pins cmac_control/ctl_rx] [get_bd_intf_pins cmac_usplus/ctl_rx]
connect_bd_intf_net [get_bd_intf_pins cmac_control/ctl_tx] [get_bd_intf_pins cmac_usplus/ctl_tx]
connect_bd_intf_net [get_bd_intf_pins cmac_control/gt_trans_debug] [get_bd_intf_pins cmac_usplus/gt_trans_debug]
connect_bd_intf_net [get_bd_intf_pins cmac_control/rs_fec] [get_bd_intf_pins cmac_usplus/rs_fec_in]
connect_bd_intf_net [get_bd_intf_pins cmac_usplus/axis_rx] [get_bd_intf_pins rx_cdc/S_AXIS]
connect_bd_intf_net [get_bd_intf_pins gt_serial_port] [get_bd_intf_pins cmac_usplus/gt_serial_port]
connect_bd_intf_net [get_bd_intf_pins cmac_control/stat_rx] [get_bd_intf_pins cmac_usplus/stat_rx]
connect_bd_intf_net [get_bd_intf_pins gt_ref_clk] [get_bd_intf_pins cmac_usplus/gt_ref_clk]
connect_bd_intf_net [get_bd_intf_pins tx_cdc/axis_out] [get_bd_intf_pins cmac_usplus/axis_tx]
connect_bd_intf_net [get_bd_intf_pins tx_in] [get_bd_intf_pins tx_cdc/axis_in]
connect_bd_net [get_bd_pins cmac_control/reset_rx_datapath] [get_bd_pins cmac_usplus/gtwiz_reset_rx_datapath]
connect_bd_net [get_bd_pins cmac_control/rx_resetn_out] [get_bd_pins tx_cdc/cmac_resetn] [get_bd_pins rx_cdc/cmac_resetn]
connect_bd_net [get_bd_pins cmac_control/sync_rx_aligned] [get_bd_pins rx_aligned_cdc/src_in]
connect_bd_net [get_bd_pins cmac_usplus/gt_txusrclk2] \
  [get_bd_pins tx_cdc/cmac_clk] [get_bd_pins rx_cdc/cmac_clk] [get_bd_pins cmac_usplus/rx_clk] \
  [get_bd_pins rx_aligned_cdc/src_clk] [get_bd_pins cmac_control/rx_clk]
connect_bd_net [get_bd_pins rx_aligned_cdc/dest_out] [get_bd_pins rx_aligned]
connect_bd_net [get_bd_pins sys_clk] \
  [get_bd_pins tx_cdc/sys_clk] [get_bd_pins rx_cdc/sys_clk] [get_bd_pins cmac_usplus/gt_drpclk] \
  [get_bd_pins cmac_usplus/init_clk] [get_bd_pins cmac_usplus/drp_clk] [get_bd_pins rx_aligned_cdc/dest_clk]
connect_bd_net [get_bd_pins sys_resetn_in] [get_bd_pins tx_cdc/sys_resetn] [get_bd_pins cmac_control/sys_resetn_in]

current_bd_instance /channel_0/eth/tx_cdc
connect_bd_intf_net [get_bd_intf_pins axis_in] [get_bd_intf_pins cdc_fifo/S_AXIS]
connect_bd_intf_net [get_bd_intf_pins cdc_fifo/M_AXIS] [get_bd_intf_pins packet_fifo/S_AXIS]
connect_bd_intf_net [get_bd_intf_pins axis_out] [get_bd_intf_pins packet_fifo/M_AXIS]
connect_bd_net [get_bd_pins cmac_clk] [get_bd_pins cdc_fifo/m_axis_aclk] [get_bd_pins packet_fifo/s_axis_aclk]
connect_bd_net [get_bd_pins cmac_resetn] [get_bd_pins packet_fifo/s_axis_aresetn]
connect_bd_net [get_bd_pins sys_clk] [get_bd_pins cdc_fifo/s_axis_aclk]
connect_bd_net [get_bd_pins sys_resetn] [get_bd_pins cdc_fifo/s_axis_aresetn]

current_bd_instance /channel_0/eth/rx_cdc
connect_bd_intf_net [get_bd_intf_pins S_AXIS] [get_bd_intf_pins axis_register_slice/S_AXIS]
connect_bd_intf_net [get_bd_intf_pins M_AXIS] [get_bd_intf_pins cdc_fifo/M_AXIS]
connect_bd_intf_net [get_bd_intf_pins axis_register_slice/M_AXIS] [get_bd_intf_pins cdc_fifo/S_AXIS]
connect_bd_net -net cmac_control_rx_resetn_out [get_bd_pins cmac_resetn] \
  [get_bd_pins cdc_fifo/s_axis_aresetn] [get_bd_pins axis_register_slice/aresetn]
connect_bd_net -net cmac_usplus_gt_txusrclk2 [get_bd_pins cmac_clk] [get_bd_pins cdc_fifo/s_axis_aclk] [get_bd_pins axis_register_slice/aclk]
connect_bd_net [get_bd_pins sys_clk] [get_bd_pins cdc_fifo/m_axis_aclk]

current_bd_instance /
connect_bd_intf_net [get_bd_intf_ports pcie_refclk] [get_bd_intf_pins pcie_bridge/PCIE_REFCLK]
connect_bd_intf_net [get_bd_intf_pins abm_and_smem/S_AXI_CTL] [get_bd_intf_pins smartconnect/M01_AXI]
connect_bd_intf_net [get_bd_intf_pins packet_generator/S_AXI_LOAD_CTL] [get_bd_intf_pins smartconnect/M05_AXI]
connect_bd_intf_net [get_bd_intf_pins packet_generator/S_AXI_POKE_CTL] [get_bd_intf_pins smartconnect/M02_AXI]
connect_bd_intf_net [get_bd_intf_pins packet_generator/S_AXI_SEND_CTL] [get_bd_intf_pins smartconnect/M00_AXI]
connect_bd_intf_net [get_bd_intf_pins channel_0/M_AXI] [get_bd_intf_pins abm_and_smem/S_AXI_RAM0_ETH]
connect_bd_intf_net [get_bd_intf_pins channel_1/M_AXI] [get_bd_intf_pins abm_and_smem/S_AXI_RAM1_ETH]
connect_bd_intf_net [get_bd_intf_ports qsfp1_gt] [get_bd_intf_pins channel_1/qsfp_gt]
connect_bd_intf_net [get_bd_intf_ports qsfp0_gt] [get_bd_intf_pins channel_0/qsfp_gt]
connect_bd_intf_net [get_bd_intf_ports qsfp0_clk] [get_bd_intf_pins channel_0/qsfp_clk]
connect_bd_intf_net [get_bd_intf_pins packet_generator/AXIS_TX0] [get_bd_intf_pins channel_1/tx_in]
connect_bd_intf_net [get_bd_intf_pins packet_generator/AXIS_TX1] [get_bd_intf_pins channel_0/tx_in]
connect_bd_intf_net [get_bd_intf_pins packet_generator/PCI_AXI] [get_bd_intf_pins pcie_bridge/S02_AXI]
connect_bd_intf_net [get_bd_intf_pins smartconnect/S00_AXI] [get_bd_intf_pins pcie_bridge/M_AXI_B]
connect_bd_intf_net [get_bd_intf_ports pcie_mgt] [get_bd_intf_pins pcie_bridge/pcie_mgt]
connect_bd_intf_net [get_bd_intf_ports qsfp1_clk] [get_bd_intf_pins channel_1/qsfp1_clk]
connect_bd_intf_net [get_bd_intf_pins smartconnect/M03_AXI] [get_bd_intf_pins chip_power/S_AXI]
connect_bd_intf_net [get_bd_intf_pins smartconnect/M04_AXI] [get_bd_intf_pins adc_bank/S_AXI]
connect_bd_intf_net [get_bd_intf_pins smartconnect/M06_AXI] [get_bd_intf_pins abm_and_smem/AXI_CLOCK_CTL]
connect_bd_intf_net [get_bd_intf_pins abm_and_smem/S_AXI_RAM0_PCI] [get_bd_intf_pins pcie_bridge/S00_AXI]
connect_bd_intf_net [get_bd_intf_pins abm_and_smem/S_AXI_RAM1_PCI] [get_bd_intf_pins pcie_bridge/S01_AXI]
connect_bd_net [get_bd_ports UCI_ADC_MISO] [get_bd_pins adc_bank/UCI_ADC_MISO]
connect_bd_net -net abm_and_smem_ext_hsi_clk [get_bd_pins abm_and_smem/pin_hsi_pclk] [get_bd_ports CHIP_HSI_CLK]
connect_bd_net -net abm_and_smem_ext_hsi_cmd [get_bd_pins abm_and_smem/pin_hsi_cmd] [get_bd_ports CHIP_HSI_CMD]
connect_bd_net -net abm_and_smem_ext_hsi_data [get_bd_pins abm_and_smem/pin_hsi_data] [get_bd_ports CHIP_HSI_DATA]
connect_bd_net -net abm_and_smem_ext_hsi_valid [get_bd_pins abm_and_smem/pin_hsi_valid] [get_bd_ports CHIP_HSI_VALID]
connect_bd_net -net abm_and_smem_ext_spi_clk [get_bd_pins abm_and_smem/chip_spi_pclk] [get_bd_ports CHIP_SPI_CLK]
connect_bd_net -net abm_and_smem_ext_spi_cs_n [get_bd_pins abm_and_smem/pin_spi_cs_n] [get_bd_ports CHIP_SPI_CSN]
connect_bd_net -net abm_and_smem_ext_spi_mosi [get_bd_pins abm_and_smem/pin_spi_mosi] [get_bd_ports CHIP_SPI_MOSI]
connect_bd_net [get_bd_pins allow_writes_to_smem/dout] [get_bd_pins abm_and_smem/sys_smem_wen]
connect_bd_net [get_bd_pins channel_0/rx_aligned] [get_bd_ports qsfp0_up]
connect_bd_net [get_bd_pins channel_1/rx_aligned] [get_bd_ports qsfp1_up]
connect_bd_net [get_bd_pins chip_power/LVL_TRSL_OE_N] [get_bd_ports LVL_TRSL_OE_N]
connect_bd_net -net ext_spi_miso_1 [get_bd_ports CHIP_SPI_MISO] [get_bd_pins abm_and_smem/pin_spi_miso]
connect_bd_net -net indy_power_ctl_0_chip_reset_n [get_bd_pins chip_power/CHIP_RESET_N] [get_bd_ports CHIP_RESET_N]
connect_bd_net -net indy_power_ctl_0_chip_vdd_n [get_bd_pins chip_power/CHIP_VDD] [get_bd_ports CHIP_VDD]
connect_bd_net -net indy_power_ctl_0_chip_vdda_n [get_bd_pins chip_power/CHIP_VDDA] [get_bd_ports CHIP_VDDA]
connect_bd_net -net indy_power_ctl_0_chip_vddio_n [get_bd_pins chip_power/CHIP_VDDIO] [get_bd_ports CHIP_VDDIO]
connect_bd_net -net indy_power_ctl_0_chip_vddlvds_n [get_bd_pins chip_power/CHIP_VDDLVDS] [get_bd_ports CHIP_VDDLVDS]
connect_bd_net -net ltc1867l_slave_select [get_bd_pins adc_bank/UCI_ADC_CSN] [get_bd_ports UCI_ADC_CSN]
connect_bd_net -net ltc1867l_spi_mosi [get_bd_pins adc_bank/UCI_ADC_MOSI] [get_bd_ports UCI_ADC_MOSI]
connect_bd_net -net ltc1867l_spi_sclk [get_bd_pins adc_bank/UCI_ADC_SCK] [get_bd_ports UCI_ADC_SCK]
connect_bd_net -net pcie_bridge_0_axi_aclk [get_bd_pins pcie_bridge/axi_aclk] \
  [get_bd_pins abm_and_smem/sys_clk] [get_bd_pins smartconnect/aclk] [get_bd_pins packet_generator/clk] \
  [get_bd_pins channel_0/sys_clk] [get_bd_pins channel_1/sys_clk] [get_bd_pins adc_bank/clk] [get_bd_pins chip_power/clk]
connect_bd_net -net pcie_bridge_0_axi_aresetn [get_bd_pins pcie_bridge/axi_aresetn] \
  [get_bd_pins packet_generator/resetn] [get_bd_pins smartconnect/aresetn] [get_bd_pins abm_and_smem/sys_resetn] \
  [get_bd_pins channel_0/sys_resetn_in] [get_bd_pins channel_1/sys_resetn_in] [get_bd_pins adc_bank/resetn] \
  [get_bd_pins chip_power/resetn]

# ---- address map ----
assign_bd_address -offset 0x0000000000000000 -range 1M -target_address_space [get_bd_addr_spaces abm_and_smem/abm_manager/abm_loader_0/ABM_AXI] [get_bd_addr_segs abm_and_smem/abm_manager/muxed_sdp_ram_if_0/S1_AXI/reg0]
assign_bd_address -offset 0x0000000000000000 -range 16E -target_address_space [get_bd_addr_spaces abm_and_smem/abm_manager/abm_loader_0/PCI_AXI] [get_bd_addr_segs pcie_bridge/pcie_bridge_0/S_AXI_B/BAR0]
assign_bd_address -offset 0x0000000000000000 -range 1M -target_address_space [get_bd_addr_spaces abm_and_smem/abm_manager/abm_loader_1/ABM_AXI] [get_bd_addr_segs abm_and_smem/abm_manager/muxed_sdp_ram_if_1/S1_AXI/reg0]
assign_bd_address -offset 0x0000000000000000 -range 16E -target_address_space [get_bd_addr_spaces abm_and_smem/abm_manager/abm_loader_1/PCI_AXI] [get_bd_addr_segs pcie_bridge/pcie_bridge_0/S_AXI_B/BAR0]
assign_bd_address -offset 0x000 -range 4K -target_address_space [get_bd_addr_spaces abm_and_smem/chipif_cdc/clock_manager/clock_mgr/M_AXI] [get_bd_addr_segs abm_and_smem/chipif_cdc/clock_manager/chipif_clock/s_axi_lite/Reg]
assign_bd_address -offset 0x00000 -range 1M -target_address_space [get_bd_addr_spaces abm_and_smem/smem_writer/fetch_abm/M_ABM] [get_bd_addr_segs abm_and_smem/abm_manager/abm_manager_if/S_AXI/reg0]
assign_bd_address -offset 0x00000 -range 1M -target_address_space [get_bd_addr_spaces abm_and_smem/smem_writer/fetch_abm/M_SMC] [get_bd_addr_segs abm_and_smem/smem_writer/cache/smem_cache_ctl/S_AXI/Mem0]
assign_bd_address -offset 0x0000000000000000 -range 1M -target_address_space [get_bd_addr_spaces channel_0/rdmx_recv/M_AXI] [get_bd_addr_segs abm_and_smem/abm_manager/muxed_sdp_ram_if_0/S0_AXI/reg0]
assign_bd_address -offset 0x0000000000000000 -range 1M -target_address_space [get_bd_addr_spaces channel_1/rdmx_recv/M_AXI] [get_bd_addr_segs abm_and_smem/abm_manager/muxed_sdp_ram_if_1/S0_AXI/reg0]
assign_bd_address -offset 0x0000000000000000 -range 1M -target_address_space [get_bd_addr_spaces packet_generator/load_from_host_ram/abm_loader/ABM_AXI] [get_bd_addr_segs packet_generator/BRAM/axi_bram_ctrl/S_AXI/Mem0]
assign_bd_address -offset 0x0000000000000000 -range 16E -target_address_space [get_bd_addr_spaces packet_generator/load_from_host_ram/abm_loader/PCI_AXI] [get_bd_addr_segs pcie_bridge/pcie_bridge_0/S_AXI_B/BAR0]
assign_bd_address -offset 0x00000 -range 1M -target_address_space [get_bd_addr_spaces packet_generator/poke/initial_fill/M_AXI] [get_bd_addr_segs packet_generator/BRAM/axi_bram_ctrl/S_AXI/Mem0]
assign_bd_address -offset 0x00000 -range 1M -target_address_space [get_bd_addr_spaces packet_generator/poke/poke/M_AXI] [get_bd_addr_segs packet_generator/BRAM/axi_bram_ctrl/S_AXI/Mem0]
assign_bd_address -offset 0x0000000000000000 -range 1M -target_address_space [get_bd_addr_spaces packet_generator/transmit/abm_sender_0/DST_AXI] [get_bd_addr_segs packet_generator/transmit/rdmx_xmit_0/S_AXI/reg0]
assign_bd_address -offset 0x0000000000000000 -range 1M -target_address_space [get_bd_addr_spaces packet_generator/transmit/abm_sender_0/SRC_AXI] [get_bd_addr_segs packet_generator/BRAM/axi_bram_ctrl/S_AXI/Mem0]
assign_bd_address -offset 0x0000000000000000 -range 1M -target_address_space [get_bd_addr_spaces packet_generator/transmit/abm_sender_1/DST_AXI] [get_bd_addr_segs packet_generator/transmit/rdmx_xmit_1/S_AXI/reg0]
assign_bd_address -offset 0x0000000000000000 -range 1M -target_address_space [get_bd_addr_spaces packet_generator/transmit/abm_sender_1/SRC_AXI] [get_bd_addr_segs packet_generator/BRAM/axi_bram_ctrl/S_AXI/Mem0]
assign_bd_address -offset 0x00000000 -range 512M -target_address_space [get_bd_addr_spaces pcie_bridge/axi4_lite_plug/M_AXI] [get_bd_addr_segs pcie_bridge/pcie_bridge_0/S_AXI_LITE/CTL0]
assign_bd_address -offset 0x0000000000001000 -range 256 -target_address_space [get_bd_addr_spaces pcie_bridge/pcie_bridge_0/M_AXI_B] [get_bd_addr_segs abm_and_smem/abm_and_smem_ctl/S_AXI/reg0]
assign_bd_address -offset 0x0000000000002000 -range 256 -target_address_space [get_bd_addr_spaces pcie_bridge/pcie_bridge_0/M_AXI_B] [get_bd_addr_segs packet_generator/poke/poke_ctl/S_AXI/reg0]
assign_bd_address -offset 0x0000000000003000 -range 256 -target_address_space [get_bd_addr_spaces pcie_bridge/pcie_bridge_0/M_AXI_B] [get_bd_addr_segs packet_generator/transmit/abm_send_ctl/S_AXI/reg0]
assign_bd_address -offset 0x0000000000004000 -range 256 -target_address_space [get_bd_addr_spaces pcie_bridge/pcie_bridge_0/M_AXI_B] [get_bd_addr_segs chip_power/indy_power_ctl/S_AXI/reg0]
assign_bd_address -offset 0x0000000000005000 -range 256 -target_address_space [get_bd_addr_spaces pcie_bridge/pcie_bridge_0/M_AXI_B] [get_bd_addr_segs adc_bank/axi_adc_bank/S_AXI/reg0]
assign_bd_address -offset 0x0000000000006000 -range 256 -target_address_space [get_bd_addr_spaces pcie_bridge/pcie_bridge_0/M_AXI_B] [get_bd_addr_segs packet_generator/load_from_host_ram/test_abm_ctl/S_AXI/reg0]
assign_bd_address -offset 0x0000000000007000 -range 256 -target_address_space [get_bd_addr_spaces pcie_bridge/pcie_bridge_0/M_AXI_B] [get_bd_addr_segs abm_and_smem/chipif_cdc/clock_manager/clock_mgr_ctl/S_AXI/reg0]

validate_bd_design
save_bd_design
